# EAGLE schematic parakeet_board_rev.06 (EAGLE 7.5.0)
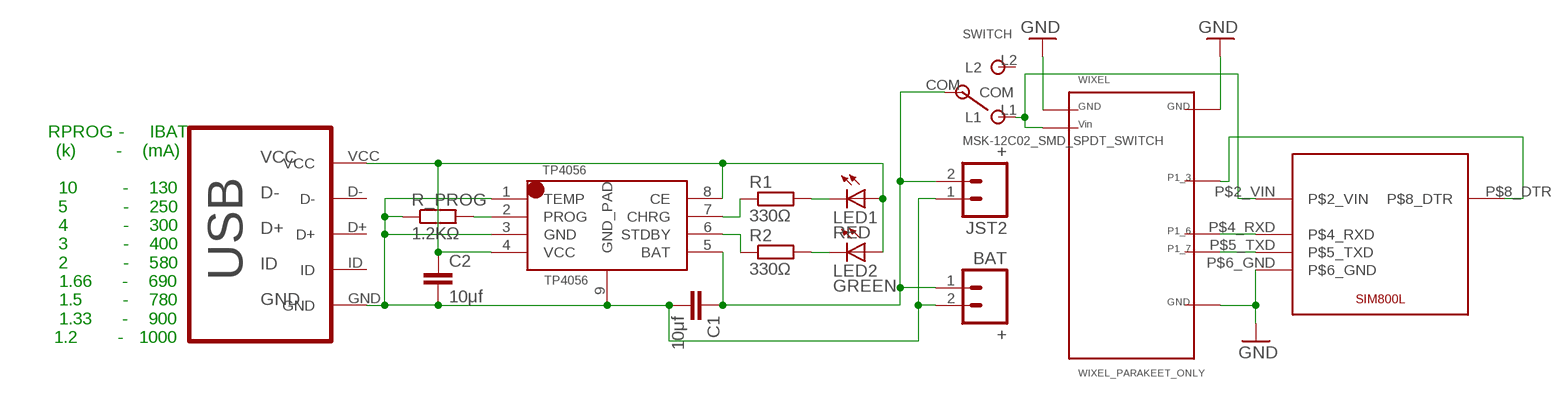
[diagram p0: schematic, sheet 1]

## Parts
+  BAT  M02PTH  [1X02]
C1  10μf  C-EUC1206  [C1206]
C2  10μf  C-EUC1206  [C1206]
JST2  +  M02-JST-2MM-SMT  [JST-2-SMD]
LED1  RED  LEDCHIPLED_1206  [CHIPLED_1206]
LED2  GREEN  LEDCHIPLED_1206  [CHIPLED_1206]
R1  330Ω  R-EU_R1206  [R1206]
R2  330Ω  R-EU_R1206  [R1206]
R_PROG  1.2KΩ  R-EU_R1206  [R1206]
SIM800L  SIM800L_PARAKEET_ONLY  [SIM800L_PARAKEET_ONLY]
SWITCH  MSK-12C02_SMD_SPDT_SWITCH  [MSK-12C02]
TP4056  TP4056  [SOP-8]
USB  MICRO-USB-B  [MICRO_USB_4_LEGS]
WIXEL  WIXEL_PARAKEET_ONLY  [WIXEL_PARAKEET_ONLY]

## Nets
GND: +.2 C1.2 C2.2 JST2.1 R_PROG.1 SIM800L.P$6_GND TP4056.1(TEMP) TP4056.3(GND) TP4056.9(GND_PAD) USB.GND WIXEL.P$1(P$1-GND1) WIXEL.P$12(P$12-GND2) WIXEL.P$23(P$23-GND3)
N$1: R_PROG.2 TP4056.2(PROG)
N$2: SIM800L.P$5_TXD WIXEL.P$20(P$20-P1_7)
N$3: LED1.C R1.2
N$4: LED2.C R2.2
N$5: R1.1 TP4056.7(CHRG)
N$6: R2.1 TP4056.6(STDBY)
N$7: C2.1 LED1.A LED2.A TP4056.4(VCC) TP4056.8(CE) USB.VCC
N$8: +.1 C1.1 JST2.2 SWITCH.COM TP4056.5(BAT)
N$9: SIM800L.P$4_RXD WIXEL.P$19(P$19-P1_6)
N$12: SIM800L.P$2_VIN SWITCH.L1 WIXEL.P$2(P$2-VIN)
N$13: SIM800L.P$8_DTR WIXEL.P$16(P$16-P1_3)
Unconnected: SWITCH.L2 USB.D+ USB.D- USB.ID

## Notes on the sheet
- RPROG -     IBAT
  (k)        -    (mA)
  
  10         -    130
  5           -    250
  4           -    300
  3           -    400
  2           -    580
  1.66      -    690
  1.5        -    780
  1.33      -    900
  1.2        -   1000

## Library data of the parts
+ = SparkFun-Connectors:M02: Standard 2-pin 0.1" header. Use with - straight break away headers ( PRT-00116) - right angle break away headers (PRT-00553) - swiss pins (PRT-00743) - machine pins (PRT-00117) - female headers (PRT-00115) Molex polarized connector foot print use with: PRT-08233 with associated crimp pins and housings. 2.54_SCREWTERM for use with PRT-10571. 3.5mm Screw Terminal footprints for PRT-08084 5mm Screw Terminal footprints for use with PRT-08432
C1 C2 = resistor:C-EU: CAPACITOR, European symbol
JST2 = SparkFun-Connectors:M02: Standard 2-pin 0.1" header. Use with - straight break away headers ( PRT-00116) - right angle break away headers (PRT-00553) - swiss pins (PRT-00743) - machine pins (PRT-00117) - female headers (PRT-00115) Molex polarized connector foot print use with: PRT-08233 with associated crimp pins and housings. 2.54_SCREWTERM for use with PRT-10571. 3.5mm Screw Terminal footprints for PRT-08084 5mm Screw Terminal footprints for use with PRT-08432; PROD_ID: CONN-11443
LED1 LED2 = led:LED: LED OSRAM: - CHIPLED LG R971, LG N971, LY N971, LG Q971, LY Q971, LO R971, LY R971 LH N974, LH R974 LS Q976, LO Q976, LY Q976 LO Q996 - Hyper CHIPLED LW Q18S LB Q993, LB Q99A, LB R99A - SideLED LS A670, LO A670, LY A670, LG A670, LP A670 LB A673, LV A673, LT A673, LW A673 LH A674 LY A675 LS A676, LA A676, LO A676, LY A676, LW A676 LS A679, LY A679, LG A679 - Hyper Micro SIDELED® LS Y876, LA Y876, LO Y876, LY Y876 LT Y87S - SmartLED LW L88C, LW L88S LB L89C, LB L89S, LG L890 LS L89K, LO L89K, LY L89K LS L896, LA L896, LO L896, LY L896 - TOPLED LS T670, LO T670, LY T670, LG T670, LP T670 LSG T670, LSP T670, LSY T670, LOP T670, LYG T670 LG T671, LOG T671, LSG T671 LB T673, LV T673, LT T673, LW T673 LH T674 LS T676, LA T676, LO T676, LY T676, LB T676, LH T676, LSB T676, LW T676 LB T67C, LV T67C, LT T67C, LS T67K, LO T67K, LY T67K, LW E67C LS E67B, LA E67B, LO E67B, LY E67B, LB E67C, LV E67C, LT E67C LW T67C LS T679, LY T679, LG T679 LS T770, LO T770, LY T770, LG T770, LP T770 LB T773, LV T773, LT T773, LW T773 LH T774 LS E675, LA E675, LY E675, LS T675 LS T776, LA T776, LO T776, LY T776, LB T776 LHGB T686 LT T68C, LB T68C - Hyper Mini TOPLED® LB M676 - Mini TOPLED Santana® LG M470 LS M47K, LO M47K, LY M47K Source: http://www.osram.convergy.de LUXEON: - LUMILED® LXK2-PW12-R00, LXK2-PW12-S00, LXK2-PW14-U00, LXK2-PW14-V00 LXK2-PM12-R00, LXK2-PM12-S00, LXK2-PM14-U00 LXK2-PE12-Q00, LXK2-PE12-R00, LXK2-PE12-S00, LXK2-PE14-T00, LXK2-PE14-U00 LXK2-PB12-K00, LXK2-PB12-L00, LXK2-PB12-M00, LXK2-PB14-N00, LXK2-PB14-P00, LXK2-PB14-Q00 LXK2-PR12-L00, LXK2-PR12-M00, LXK2-PR14-Q00, LXK2-PR14-R00 LXK2-PD12-Q00, LXK2-PD12-R00, LXK2-PD12-S00 LXK2-PH12-R00, LXK2-PH12-S00 LXK2-PL12-P00, LXK2-PL12-Q00, LXK2-PL12-R00 Source: www.luxeon.com KINGBRIGHT: KA-3528ASYC Source: www.kingbright.com
R1 R2 R_PROG = resistor:R-EU_: RESISTOR, European symbol
SIM800L = SIM800L Module:SIM800L_PARAKEET_ONLY
SWITCH = MSK-12C02 SMD Micro Slider Switch SPDT:MSK-12C02_SMD_SPDT_SWITCH: Footprint of the VIMEX MSK-12C02 SPDT SMD Switch Created by mzst on 17-Jan-2016
TP4056 = TP4056:TP4056
USB = micro usb B - sparkfun - china - hole 4LEGS TEST:MICRO-USB-B
WIXEL = wixel:WIXEL_PARAKEET_ONLY